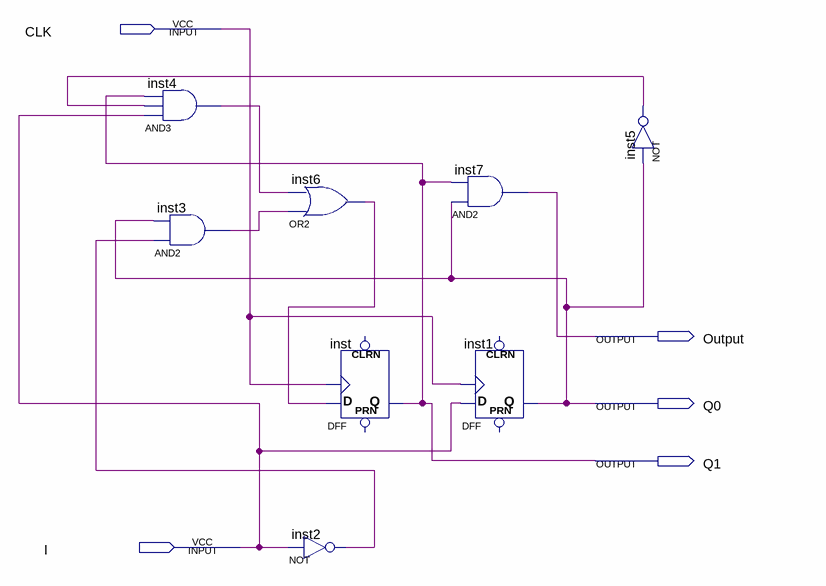
[diagram p0: schematic sheet]
// Quartus schematic Moore-type.bdf as structural Verilog: 8 symbols, 5 pins
module \Moore-type  (
  input  CLK,
  input  I,
  output Output,
  output Q0,
  output Q1
);

  wire inst2_out, inst3_out, inst4_out, inst5_out, inst6_out;

  and inst4 (inst4_out, I, inst5_out, Q1);
  and inst3 (inst3_out, inst2_out, Q0);
  or inst6 (inst6_out, inst3_out, inst4_out);
  not inst2 (inst2_out, I);
  DFF inst (.CLK(CLK), .D(inst6_out), .Q(Q1));  // open: CLRN, PRN
  and inst7 (Output, Q0, Q1);
  DFF inst1 (.CLK(CLK), .D(I), .Q(Q0));  // open: CLRN, PRN
  not inst5 (inst5_out, Q0);
endmodule
